# EAGLE design core-feather-shield-adc-imu-basic_v1_0 (EAGLE 9.5.0)
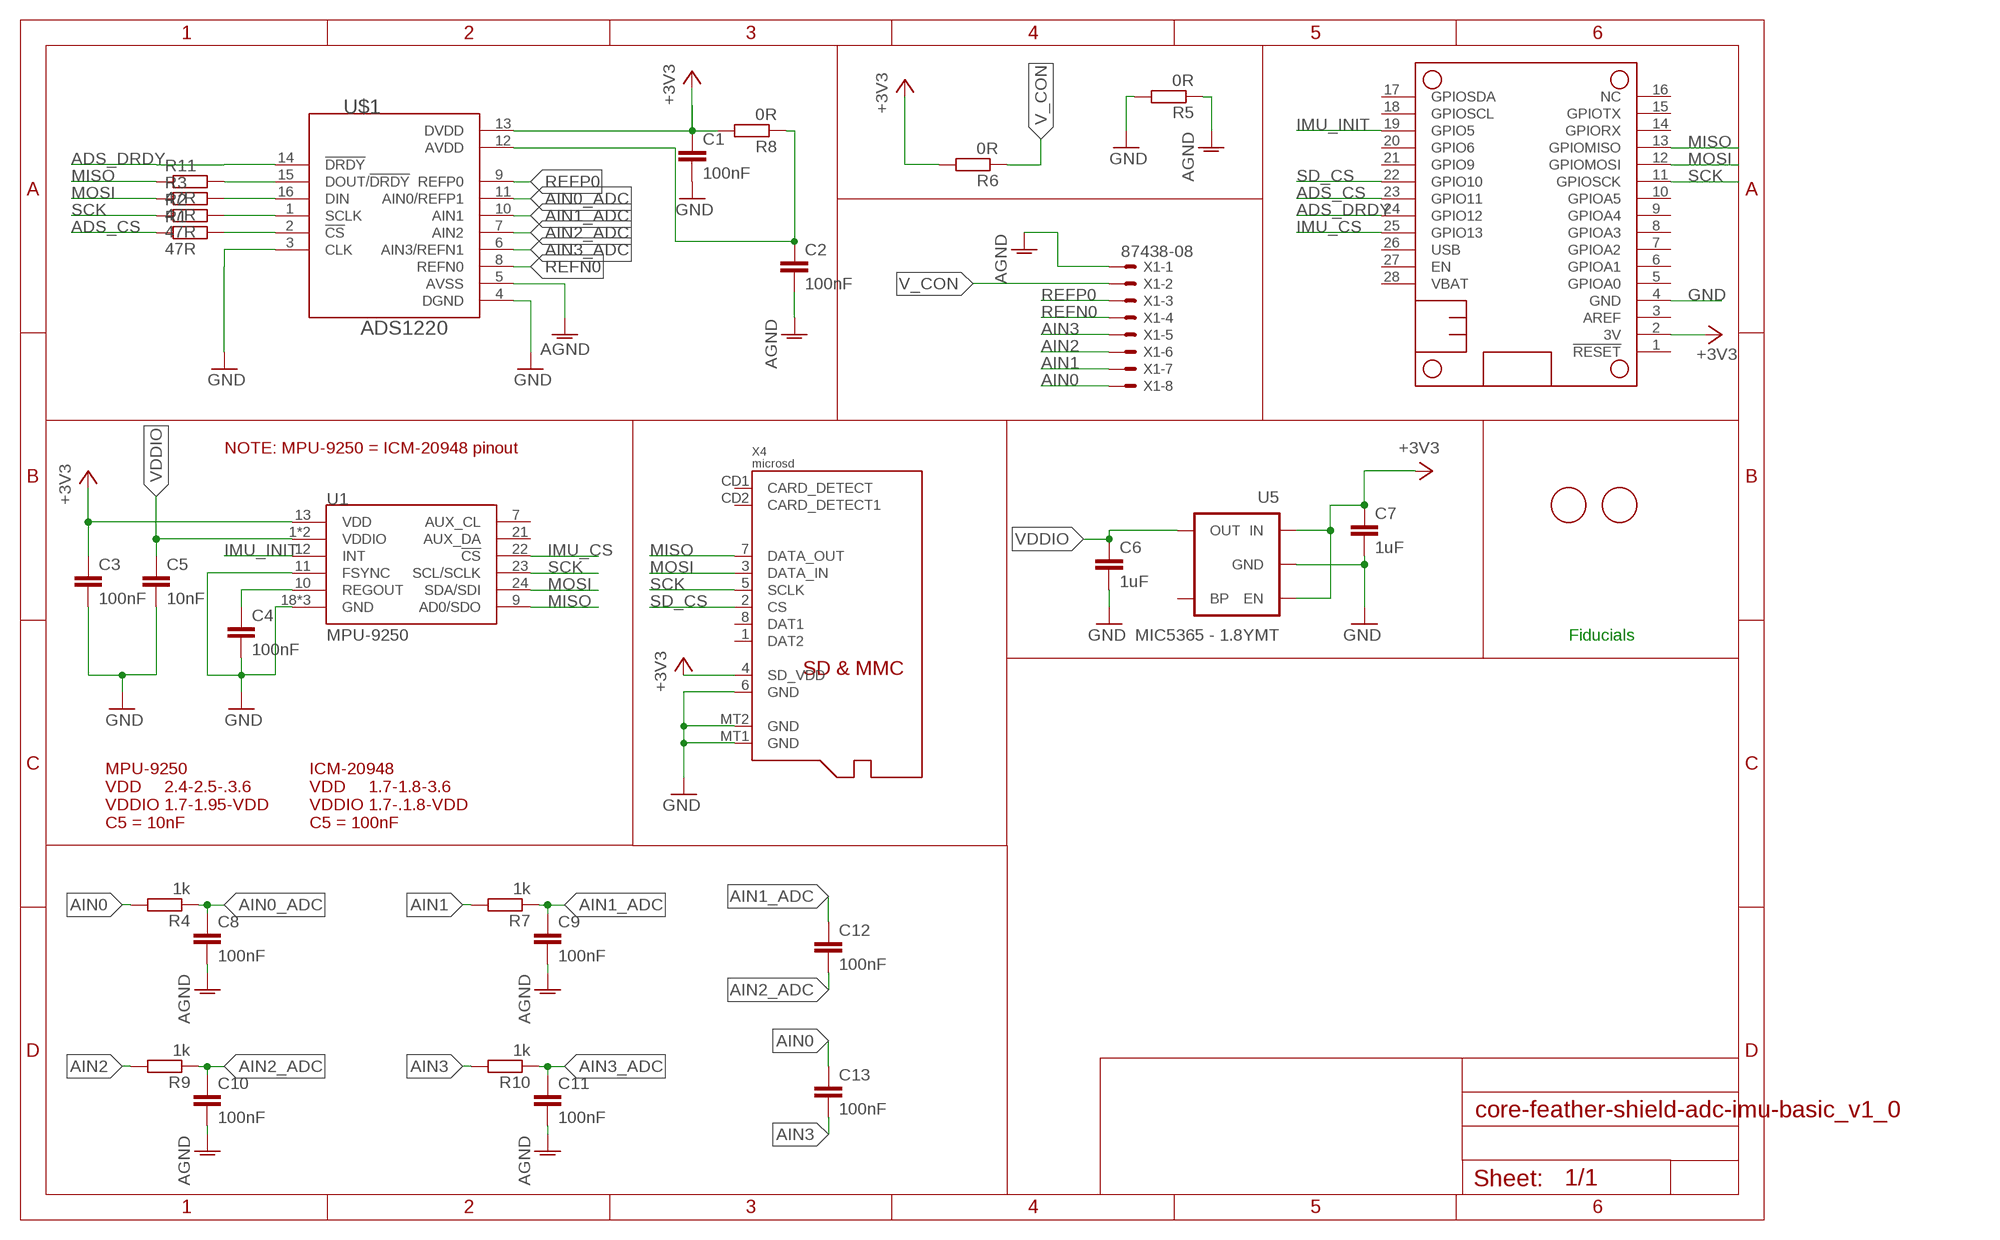
[diagram p0: schematic, sheet 1]

## Parts
C1  100nF  C-EUC0805  [C0805]
C2  100nF  C-EUC0805  [C0805]
C3  100nF  C-EUC0805  [C0805]
C4  100nF  C-EUC0805  [C0805]
C5  10nF  C-EUC0805  [C0805]
C6  1uF  C-EUC0805  [C0805]
C7  1uF  C-EUC0805  [C0805]
C8  100nF  C-EUC0805  [C0805]
C9  100nF  C-EUC0805  [C0805]
C10  100nF  C-EUC0805  [C0805]
C11  100nF  C-EUC0805  [C0805]
C12  100nF  C-EUC0805  [C0805]
C13  100nF  C-EUC0805  [C0805]
MS1  FEATHERWING  [FEATHERWING]
R1  47R  R-EU_R0805  [R0805]
R2  47R  R-EU_R0805  [R0805]
R3  47R  R-EU_R0805  [R0805]
R4  1k  R-EU_R0805  [R0805]
R5  0R  R-EU_R0805  [R0805]
R6  0R  R-EU_R0805  [R0805]
R7  1k  R-EU_R0805  [R0805]
R8  0R  R-EU_R0805  [R0805]
R9  1k  R-EU_R0805  [R0805]
R10  1k  R-EU_R0805  [R0805]
R11  47R  R-EU_R0805  [R0805]
U1  MPU-9250  [QFN24_PAD]
U5  MIC5365 - 1.8YMT  V_REG_LDOSMD2  [SC70]
U$1  ADS1220  [TSSOP-16]
U$8  FIDUCIAL  [FIDUCIAL_1MM]
U$9  FIDUCIAL  [FIDUCIAL_1MM]
X1  87438-08  [87438-08]
X4  microsd  MICROSD  [MICROSD]

## Nets
+3V3: C1.1 C3.1 C7.1 MS1.2(3V) R6.2 R8.2 U1.13(VDD) U5.1(IN) U5.3(EN) U$1.13(DVDD) X4.4(SD_VDD)
ADS_CS: MS1.23(GPIO11) R1.1
ADS_DRDY: MS1.24(GPIO12) U$1.14(!DRDY)
AGND: C2.2 C8.2 C9.2 C10.2 C11.2 R5.1 U$1.5(AVSS) X1.1
AIN0: C13.1 R4.2 X1.8
AIN0_ADC: C8.1 R4.1 U$1.11(AIN0/REFP1)
AIN1: R7.2 X1.7
AIN1_ADC: C9.1 C12.1 R7.1 U$1.10(AIN1)
AIN2: R9.2 X1.6
AIN2_ADC: C10.1 C12.2 R9.1 U$1.7(AIN2)
AIN3: C13.2 R10.2 X1.5
AIN3_ADC: C11.1 R10.1 U$1.6(AIN3/REFN1)
GND: C1.2 C3.2 C4.2 C5.2 C6.2 C7.2 MS1.4(GND) R5.2 U1.11(FSYNC) U1.18(GND) U1.20(GND) U1.CENTER(GND) U5.2(GND) U$1.4(DGND) X4.6(GND) X4.MT1(GND) X4.MT2(GND)
IMU_CS: MS1.25(GPIO13) U1.22(!CS)
IMU_INIT: MS1.19(GPIO5) U1.12(INT)
MISO: MS1.13(GPIOMISO) R11.1 U1.9(AD0/SDO) X4.7(DATA_OUT)
MOSI: MS1.12(GPIOMOSI) R3.1 U1.24(SDA/SDI) X4.3(DATA_IN)
N$1: R11.2 U$1.15(DOUT/!DRDY)
N$3: R3.2 U$1.16(DIN)
N$4: R2.2 U$1.1(SCLK)
N$5: R1.2 U$1.2(!CS)
N$7: U$1.3(CLK)
N$9: C2.1 R8.1 U$1.12(AVDD)
REFN0: U$1.8(REFN0) X1.4
REFP0: U$1.9(REFP0) X1.3
REGOUT: C4.1 U1.10(REGOUT)
SCK: MS1.11(GPIOSCK) R2.1 U1.23(SCL/SCLK) X4.5(SCLK)
SD_CS: MS1.22(GPIO10) X4.2(CS)
V_CON: R6.1 X1.2
VDDIO: C5.1 C6.1 U1.1(VDDIO) U1.8(VDDIO) U5.5(OUT)
Unconnected: MS1.1(!RESET) MS1.3(AREF) MS1.5(GPIOA0) MS1.6(GPIOA1) MS1.7(GPIOA2) MS1.8(GPIOA3) MS1.9(GPIOA4) MS1.10(GPIOA5) MS1.14(GPIORX) MS1.15(GPIOTX) MS1.16(NC) MS1.17(GPIOSDA) MS1.18(GPIOSCL) MS1.20(GPIO6) MS1.21(GPIO9) MS1.26(USB) MS1.27(EN) MS1.28(VBAT) U1.7(AUX_CL) U1.21(AUX_DA) U5.4(BP) X4.1(DAT2) X4.8(DAT1) X4.CD1(CARD_DETECT) X4.CD2(CARD_DETECT1)

## Notes on the sheet
- NOTE: MPU-9250 = ICM-20948 pinout
- Fiducials
- MPU-9250 
  VDD     2.4-2.5-.3.6
  VDDIO 1.7-1.95-VDD
  C5 = 10nF
- ICM-20948
  VDD     1.7-1.8-3.6
  VDDIO 1.7-.1.8-VDD
  C5 = 100nF

## Library data of the parts
C1-C5 C8-C13 = rcl:C-EU: CAPACITOR, European symbol
C6 C7 = rcl:C-EU: CAPACITOR, European symbol; SPICEPREFIX: C
MS1 = adafruit:FEATHERWING
R1-R11 = rcl:R-EU_: RESISTOR, European symbol; SPICEPREFIX: R
U1 = Testing:MPU-9250: NC pin 19. 2-6 & 14-17 not internally connected. May be used for PCB trace routing.; PROD_ID: IC-13192
U5 = rigado-power:V_REG_LDO: Voltage Regulator LDO Standard 150mA LDO voltage regulator in SOT-23 layout. Micrel part MIC5205. BP (by-pass) pin is used to lower output noise with 470pF cap.; DESCRIPTION: IC REG LDO 3.3V 0.15A SC70-5; EACH: 0.267; MFPN: MIC5365-3.3YC5 TR; MFR: Micrel; VEND: Digikey; VPN: 576-3193-1-ND
U$1 = circuitects:ADS1220
U$8 U$9 = audio amplifier example:FIDUCIAL: For use by pick and place machines to calibrate the vision/machine, 1mm By microbuilder.eu
X1 = con-molex:87438-08: Wire-to-Board 1.50mm (.059") Pitch Header - Right Angle, SMT, Shrouded Source: http://www.molex.com/product/micro/87438.html; MF: MOLEX; OC_FARNELL: 1756939; OC_NEWARK: unknown; SPICEPREFIX: X
X4 = microbuilder:MICROSD: MicroSD/Transflash Card Holder with SPI pinout 3M: 2908-05WB-MG 4UConnector: 19656 Footprint courtesy: Adafruit Industries

## Net classes
0 default: width 0.127 mm

## Board
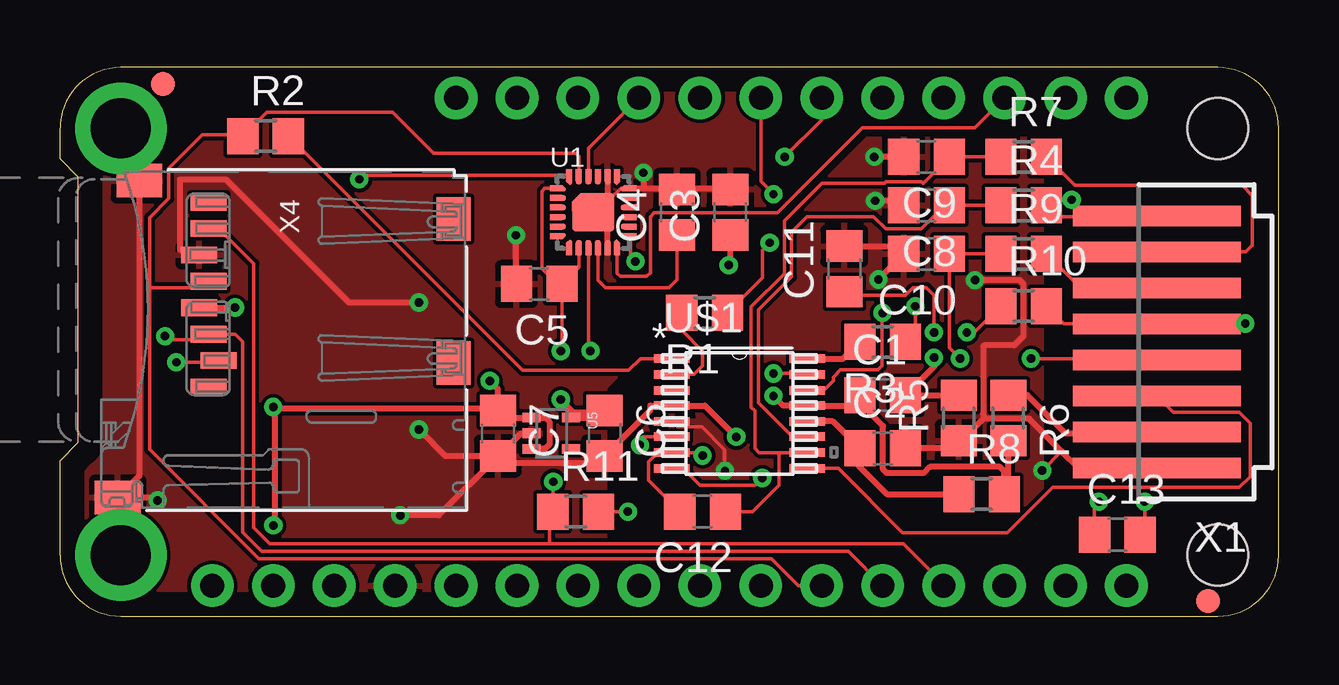
[diagram p1: board, top side]
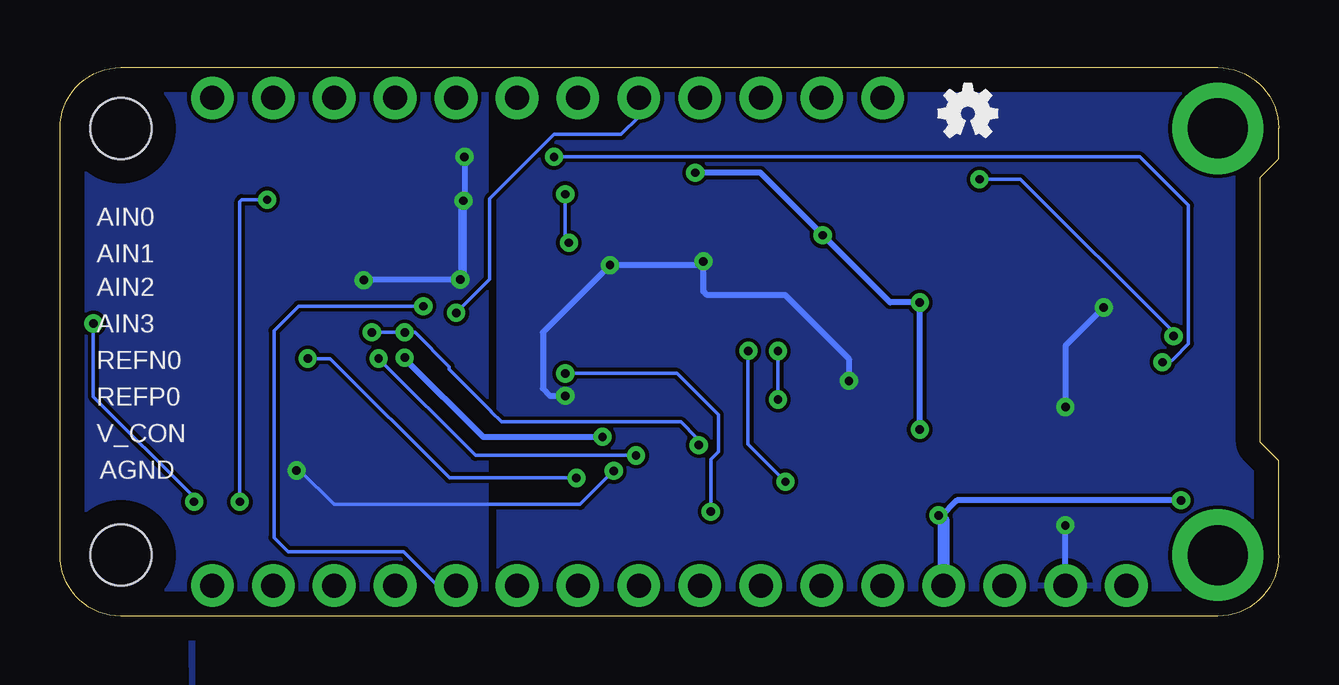
[diagram p2: board, bottom side, seen from below]

Size 50.8 x 22.86 mm. Coordinates in mm from the lower left corner, seen from the top.
Outline: 0,2.54 0,6.48 0.76,7.24 0.76,18.29 0,19.05 0,20.32
Copper layers (1*16): Top 0.035mm / dielectric 1.5mm / Bottom 0.035mm
Design rules "default": minimum track width 6mil, minimum drill 0.35mm, track to track 6mil, track to pad 6mil, pad to pad 6mil, via to via 6mil, smd to smd 6mil, copper to edge 40mil, drill to drill 6mil, minimum pad ring 10mil, minimum via ring 8mil, stop-mask expansion 4mil, vias tented up to drill 0mil, thermal gap 10mil

### Footprints (pad centres in the part's own frame; a part is rotated, then mirrored left to right if it is on the bottom)
C0805 = smd 1.3 x 1.5: 1 -0.95,0; 2 0.95,0
FEATHERWING = drill 1 pad 1.778: 1 6.35,1.27; 2 8.89,1.27; 3 11.43,1.27; 4 13.97,1.27; 5 16.51,1.27; 6 19.05,1.27; 7 21.59,1.27; 8 24.13,1.27; 9 26.67,1.27; 10 29.21,1.27; 11 31.75,1.27; 12 34.29,1.27; 13 36.83,1.27; 14 39.37,1.27; 15 41.91,1.27; 16 44.45,1.27; 17 44.45,21.59; 18 41.91,21.59; 19 39.37,21.59; 20 36.83,21.59; 21 34.29,21.59; 22 31.75,21.59; 23 29.21,21.59; 24 26.67,21.59; 25 24.13,21.59; 26 21.59,21.59; 27 19.05,21.59; 28 16.51,21.59 | drill 2.5 pad 3.81: P$1 2.54,20.32; P$2 2.54,2.54 | hole 2.54: 48.26,20.32; 48.26,2.54
R0805 = smd 1.3 x 1.5: 1 -0.95,0; 2 0.95,0
QFN24_PAD = smd 0.5 x 0.25: 1 -1.55,1; 2 -1.55,0.6; 3 -1.55,0.2; 4 -1.55,-0.2; 5 -1.55,-0.6; 6 -1.55,-1; 13 1.55,-1; 14 1.55,-0.6; 15 1.55,-0.2; 16 1.55,0.2; 17 1.55,0.6; 18 1.55,1 | smd 0.08 x 0.13: 1$1 -1.32,1.06; 1$3 -1.26,0.94; P$33 1.26,-0.94; P$34 1.32,-1.06; P$58 1.26,0.94; P$59 1.32,1.06; P$68 -1.26,-0.94; P$69 -1.32,-1.06 | smd 0.1 x 0.185 rotated 45: 1$2 -1.25,1.024; P$49 1.024,-1.25 | smd 0.14 x 0.14: 1$4 -1.22,0.945; P$23 -0.945,-1.22; P$24 1.22,-0.945; P$36 0.945,1.22; P$51 0.945,-1.22; P$56 1.22,0.945; P$61 -0.945,1.22; P$66 -1.22,-0.945 | smd 0.05 x 0.05: 1$5 -1.175,0.97; P$25 -0.97,-1.175; P$31 1.175,-0.97; P$37 0.97,1.175; P$52 0.97,-1.175; P$57 1.175,0.97; P$62 -0.97,1.175; P$67 -1.175,-0.97 | smd 0.25 x 0.5: 7 -1,-1.55; 8 -0.6,-1.55; 9 -0.2,-1.55; 10 0.2,-1.55; 11 0.6,-1.55; 12 1,-1.55; 19 1,1.55; 20 0.6,1.55; 21 0.2,1.55; 22 -0.2,1.55; 23 -0.6,1.55; 24 -1,1.55 | smd 0.25 x 0.25: CENTER 0,0 | smd 0.4 x 0.4: DBBADFE -0.675,0.24 | smd 0.6 x 1.2: DBBADFE1 -0.575,-0.195 | smd 0.25 x 0.3: P$1 -0.2,1.3; P$3 0.2,1.3; P$5 0.6,1.3; P$11 -0.6,1.3; P$16 0.2,-1.3; P$18 -0.2,-1.3; P$20 -0.6,-1.3; P$26 0.6,-1.3 | smd 0.3 x 0.25: P$2 -1.3,0.2; P$4 -1.3,0.6; P$28 -1.3,-0.2; P$38 -1.3,-0.6; P$40 1.3,0.2; P$42 1.3,-0.2; P$44 1.3,-0.6; P$50 1.3,0.6 | smd 0.1 x 0.185 rotated 225: P$7 1.25,-1.024; P$60 -1.024,1.25 | smd 1.1 x 1.59: P$13 0.325,0 | smd 0.3 x 0.5 rotated 315: P$14 -0.592,0.512 | smd 0.5 x 1.59: P$15 -0.27,0 | smd 0.1 x 0.185 rotated 135: P$22 -1.024,-1.25; P$55 1.25,1.024 | smd 0.13 x 0.08: P$27 -0.94,-1.26; P$29 -1.06,-1.32; P$39 0.94,1.26; P$41 1.06,1.32; P$53 0.94,-1.26; P$54 1.06,-1.32; P$63 -0.94,1.26; P$64 -1.06,1.32 | smd 0.1 x 0.185 rotated 315: P$35 1.024,1.25; P$65 -1.25,-1.024
SC70 = smd 0.4 x 0.75: 1 -0.65,-0.825; 2 0,-0.825; 3 0.65,-0.825; 4 0.65,0.825; 5 -0.65,0.825
TSSOP-16 = smd 1.473 x 0.356: 1 -2.819,2.656; 2 -2.819,1.996; 3 -2.819,1.335; 4 -2.819,0.7; 5 -2.819,0.04; 6 -2.819,-0.595; 7 -2.819,-1.256; 8 -2.819,-1.916; 9 2.819,-1.916; 10 2.819,-1.256; 11 2.819,-0.595; 12 2.819,0.04; 13 2.819,0.7; 14 2.819,1.335; 15 2.819,1.996; 16 2.819,2.656
FIDUCIAL_1MM = smd 1 x 1: 1 0,0
87438-08 = smd 7 x 0.85: 1 0,5.25; 2 0,3.75; 3 0,2.25; 4 0,0.75; 5 0,-0.75; 6 0,-2.25; 7 0,-3.75; 8 0,-5.25
MICROSD = smd 0.7 x 1.5: 1 9,-10.64; 2 7.9,-10.24; 3 6.8,-10.64; 4 5.7,-11.04; 5 4.6,-10.64; 6 3.5,-11.04; 7 2.4,-10.64; 8 1.3,-10.64 | smd 1.8 x 1.4: CD1 2,-0.44; CD2 8,-0.44 | smd 1.4 x 1.9: MT1 0.4,-13.54; MT2 13.6,-14.44

### Placement (x,y rotation side)
C1  34.29,9.21 0 top
C2  34.29,6.99 0 top
C3  27.94,16.83 90 top
C4  25.72,16.83 90 top
C5  19.98,13.84 180 top
C6  22.7,7.62 270 top
C7  18.26,7.62 270 top
C8  36.12,17.11 180 top
C9  36.12,19.14 180 top
C10  36.12,15.09 180 top
C11  32.7,14.47 90 top
C12  26.78,4.36 180 top
C13  44.07,3.39 0 top
FRAME2  FRAME-LETTER  [CREATIVE_COMMONS]  -0.38,-20.07 0 top  (outside the outline)
LOGO1  OSHW-LOGOMINI  [OSHW-LOGO-MINI]  12.95,20.95 0 bottom
LOGO2  REVISION  [REVISION]  11.05,-22.61 0 top  (outside the outline)
MS1  0,0 0 top
R1  26.87,12.64 180 top
R2  8.57,20 0 top
R3  34.29,11.43 180 top
R4  40.16,17.11 0 top
R5  37.47,8.26 90 top
R6  39.53,8.26 270 top
R7  40.16,19.14 0 top
R8  38.42,5.08 0 top
R9  40.16,15.09 0 top
R10  40.16,12.91 0 top
R11  21.49,4.36 0 top
U1  22.22,16.83 0 top
U5  20.48,7.62 270 top
U$1  28.32,8.07 0 top
U$8  4.29,22.17 0 top
U$9  47.86,0.63 0 top
X1  45.72,11.43 180 top
X4  16.85,18.55 270 top

### Tracks (layer width: path | path; a pad name or v marks a point on that pad's centre or on a via)
+3V3  (via drill 0.35)
  Top 0.152: U1.13 23.77,14.99 v23.98,14.78 | 8.97,8.63 v8.89,8.71
  Top 0.254: 32.91,8.77 C1.1 33.34,8.89 33.42,8.81 | R8.2 39.37,6.03 | R6.2 39.53,5.88 39.37,6.03 | 33.42,8.81 34.31,7.92 34.31,6.12 34.47,5.96 36.01,5.96 36.27,6.22 39.18,6.22 39.37,6.03 | X4.4 7.28,12.85 v7.3,12.86 | C7.1 18.26,9.46 v17.92,9.8 | C7.1 18.2,8.63 8.97,8.63 8.97,3.86 v8.89,3.78 | 33.42,8.81 33.38,8.77 U$1.13 30.15,8.77 v29.74,9.18 | C7.1 18.56,8.27 U5.1 20.23,8.27 20.41,8.09 20.41,7.16 20.22,6.97 U5.3 | v27.87,14.62 27.94,14.69 C3.1
  Bottom 0.254: v7.3,12.86 8.89,11.27 v8.89,8.71 | MS1.2 v8.89,3.78 | v29.74,9.18 30.36,9.18 30.67,9.49 30.67,11.82 v27.87,14.62 24.14,14.62 v23.98,14.78 23.98,13.54 23.83,13.38 20.56,13.38 17.92,10.73 v17.92,9.8
  pour Bottom: -1.69,25.2 32.54,25.2 32.54,-2.8 -1.53,-2.8 -1.69,-2.96
ADS_CS  (via drill 0.35)
  Top 0.152: MS1.23 29.21,18.11 v29.74,17.58 | v29.59,15.56 29.27,15.25 29.27,14.09 R1.1
  Bottom 0.152: v29.74,17.58 29.74,15.71 v29.59,15.56
ADS_DRDY  (via drill 0.35)
  Top 0.152: U$1.14 31.84,9.41 32.23,9.8 32.23,9.96 32.54,10.27 34.1,10.27 34.25,10.42 34.25,12.6 v34.29,12.63
  Bottom 0.152: MS1.24 26.67,20.81 27.41,20.07 30.21,20.07 32.88,17.39 32.88,14.04 v34.29,12.63
AGND  (via drill 0.35)
  Top 0.152: v27.72,6.05 27.7,6.05 27.7,6.94 26.76,7.88 25.73,7.88 U$1.5 | v40.94,6.07 41.75,6.88 | 38.53,11.28 38.48,11.23 | 34.84,15.42 C10.2
  Top 0.254: R5.1 | R5.1 37.15,6.99 C2.2 | X1.1 42.45,6.18 41.75,6.88 40.39,8.23 38.5,8.23 38.48,8.21 | R5.1 37.57,7.3 38.48,8.21 | C9.2 v33.94,19.14 | C8.2 34.97,17.31 v33.98,17.31 | C10.2 34.11,14.04 v34.11,14.03 | C11.2 34.84,15.42 | v38.14,14 40.01,14 40.16,13.85 40.16,11.67 39.78,11.28 38.53,11.28 | 38.48,11.23 38.48,9.98 38.49,9.97 38.49,8.44 38.48,8.43 38.48,8.21
  Bottom 0.152: v40.94,6.07 40.79,6.07 39.37,4.65 29.12,4.65 v27.72,6.05 | v34.11,14.03 34.11,17.44 33.94,17.27
  Bottom 0.254: v33.94,19.14 33.94,17.27 | v33.98,17.31 33.98,14.16 v34.11,14.03 38.12,14.03 v38.14,14
  pour Top: 23.21,0.31 40.94,0.31 40.94,19.91 33.63,19.91 23.05,9.33 23.05,0.47
  pour Bottom: 33.01,25.2 33.01,-3.42 56.34,-3.42 56.34,24.74 33.47,24.74
AGND1
  pour Bottom: 45.23,18.82 45.23,-10.2 45.71,18.35
AIN0  (via drill 0.35)
  Top 0.152: X1.8 46.08,16.68 | 46.08,16.68 49.15,16.68 | R4.2 41.24,16.98 | 41.24,16.98 41.58,16.65 46.04,16.65 46.08,16.68 | C13.1 43.12,4.58 v43.31,4.76 | v42.16,17.35 41.61,17.35 41.24,16.98
  Bottom 0.152: v43.31,4.76 43.31,17.27 43.23,17.35 v42.16,17.35
AIN0_ADC
  Top 0.152: R4.1 37.21,17.11 C8.1 36.89,17.11 35.91,16.14 34.42,16.14 33.91,16.65 31.14,16.65 30.5,16 30.5,14.14 29.12,12.76 29.12,8.9 30.62,7.4 31.06,7.4 U$1.11 31.13,7.47
AIN1
  Top 0.152: 42.75,15.18 X1.7 49.43,15.18 49.71,15.46 49.71,17.53 49.28,17.96 42.3,17.96 41.12,19.14 R7.2
AIN1_ADC
  Top 0.152: R7.1 C9.1 35.98,18.05 35.96,18.05 35.91,18.09 34.42,18.09 34.38,18.05 31.76,18.05 30.19,16.48 30.19,14.27 28.81,12.88 28.81,8.71 28.96,8.56 28.96,7 29.14,6.82 29.9,6.82 29.97,6.82 | 29.97,6.82 U$1.10 | 28.31,4.36 C12.1 28.87,4.36 29.97,5.46 29.97,6.82
AIN2
  Top 0.152: R9.2 42.53,13.68 X1.6
AIN2_ADC  (via drill 0.35)
  Top 0.152: v37.52,10.73 37.07,11.19 C10.1 R9.1 | v26.79,6.69 v26.78,6.69 26.71,6.77 26.66,6.82 U$1.7 24.93,6.82 24.54,6.43 24.54,5.65 C12.2
  Bottom 0.152: v26.79,6.69 33.48,6.69 v37.52,10.73
AIN3  (via drill 0.35)
  Top 0.152: R10.2 41.85,12.18 X1.5 49.39,12.18 v49.41,12.19 | v45.21,4.76 45.21,3.58 C13.2
  Bottom 0.152: v49.41,12.19 49.41,9.15 45.21,4.95 v45.21,4.76
AIN3_ADC  (via drill 0.35)
  Top 0.152: R10.1 38.12,11.82 v37.8,11.82 | v24.17,7.12 24.06,7.23 24.31,7.48 U$1.6 | v36.43,11.82 36.43,13.38 36.12,13.69 36.1,13.68 35.56,13.68 35.24,13.36 32.85,13.36 C11.1
  Bottom 0.152: v37.8,11.82 v36.43,11.82 36,11.82 34.58,10.4 34.58,10.28 32.84,8.54 32.84,8.52 32.4,8.09 24.92,8.09 24.26,7.43 24.17,7.43 v24.17,7.12
GND  (via drill 0.35)
  Top 0.152: 25.23,8.77 U$1.4 | U1.18 23.38,17.83 22.94,17.38 22.78,17.38 U1.CENTER 22.82,16.23 | 25.23,17.83 25.67,17.83 C4.2 C3.2 | 22.42,6.39 C6.2 | C1.2 34.8,9.65
  Top 0.254: R5.2 C1.2 36.43,10.4 v36.43,10.77 | C7.2 15.79,4.2 v14.18,4.2 | X4.MT1 3.31,5.85 X4.MT2 3.94,4.95 v4.07,4.82 | v14.96,13.07 12.04,13.07 6.9,18.2 5,18.2 5,15.25 5.61,15.25 X4.6 | C7.2 16.07,6.67 v14.96,7.78 | v24.32,18.48 24.32,17.85 24.29,17.83 | 24.29,17.83 25.23,17.83 27.89,17.83 C3.2 | U1.18 24.29,17.83 | C7.2 19.21,7.62 U5.2 | C7.2 18.54,6.39 22.42,6.39 | U$1.4 26.88,8.77 v28.18,7.47 | C6.2 24.61,8.57 24.61,8.77 25.23,8.77 | C5.2 19.01,13.86 v19.01,15.87 | U1.20 22.82,17.43 22.78,17.38 | U1.11 22.82,16.23
  Bottom 0.254: 14.11,4.12 13.97,3.99 | v14.96,7.78 v14.96,13.07 16.21,13.07 v19.01,15.87 21.61,18.48 v24.32,18.48 | v4.07,4.82 13.4,4.82 14.11,4.12 | v36.43,10.77 36.43,10.73 33.16,7.47 v28.18,7.47 | v14.18,4.2 14.11,4.12
  Bottom 0.508: v14.18,4.2 13.97,3.99 MS1.4
  pour Top: 33.63,20.38 41.25,20.38 41.25,0 23.98,0 23.98,-2.49 23.83,-2.64 55.57,-2.64 55.57,24.11 -4.18,24.11 -4.33,23.96 -4.33,-3.11 -4.49,-3.27 22.58,-3.27 22.74,-3.11 22.74,9.49
IMU_CS
  Top 0.152: U1.22 22.02,19.48 MS1.25
IMU_INIT
  Top 0.152: U1.12 23.22,14.29 23.36,14.16 24.45,14.16 24.61,14.31 24.61,16.65 24.76,16.8 29.91,16.8 33.46,20.34 38.12,20.34 MS1.19
MISO  (via drill 0.35)
  Top 0.152: 20.41,3.02 35.15,3.02 36.83,1.34 MS1.13 | 20.41,3.02 8.75,3.02 8.07,3.69 8.07,14.69 6.61,16.15 X4.7 | U1.9 22.02,11.14 v22.11,11.05 v22.12,11.05 | v20.56,5.6 20.54,5.58 R11.1 20.41,4.22 20.41,3.17 20.41,3.02
  Bottom 0.152: v20.56,5.6 22.12,7.16 v22.12,11.05 v22.11,11.05
MOSI  (via drill 0.35)
  Top 0.152: 5.94,11.75 X4.3 | 5.94,11.75 7.3,11.75 7.62,11.43 7.62,3.49 8.41,2.7 32.86,2.7 MS1.12 | U1.24 12.65,18.38 v12.47,18.2 | 5.94,11.75 5.7,11.51 4.54,11.51 v4.38,11.67 | R3.1 35.65,11.84 v35.65,12.91
  Bottom 0.152: v12.47,18.2 10.76,18.2 4.38,11.82 v4.38,11.67 | v35.65,12.91 40.86,12.91 41.88,11.89 41.88,3.27 41.3,2.69 36.48,2.69 35.05,1.27 MS1.12
N$1  (via drill 0.35)
  Top 0.152: R11.2 v23.67,4.36 | v29.74,10.11 31.1,10.11 U$1.15
  Bottom 0.152: v23.67,4.36 23.67,6.53 23.36,6.84 23.36,8.4 25.07,10.11 v29.74,10.11
N$3
  Top 0.254: U$1.16 32.64,10.73 R3.2
N$4
  Top 0.152: U$1.1 24.2,10.73 23.7,10.24 19.29,10.24 R2.2
N$5
  Top 0.152: R1.2 25.92,11.91 26.78,11.05 26.78,10.42 26.43,10.07 U$1.2
N$9
  Top 0.254: U$1.12 32.21,8.11 C2.1 33.28,6.93 33.28,6.26 34.46,5.08 R8.1
REFN0  (via drill 0.35)
  Top 0.152: v40.48,10.73 45.67,10.73 X1.4 | v29.27,5.76 28.96,5.45 26.68,5.45 25.97,6.16 U$1.8
  Bottom 0.152: v29.27,5.76 34.56,5.76 39.54,10.73 v40.48,10.73
REFP0
  Top 0.152: X1.3 46.41,8.49 49.16,8.49 49.6,8.04 49.6,5.82 49.16,5.37 41.38,5.37 39.49,3.48 35.12,3.48 32.44,6.16 U$1.9
REGOUT
  Top 0.152: U1.10 22.43,14 22.74,13.69 25.38,13.69 25.72,14.02 C4.1
SCK
  Top 0.152: MS1.11 30.79,1.27 29.66,2.4 8.28,2.4 3.74,6.94 3.74,13.69 | 3.74,13.69 3.74,16.61 4.54,17.41 4.54,18.67 5.92,20.05 7.67,20.05 | 7.3,20 R2.1 7.67,20.05 | 7.67,20.05 8.62,21 13.87,21 15.58,19.29 21.5,19.29 21.62,19.16 U1.23 | X4.5 5.95,13.69 3.74,13.69
SD_CS  (via drill 0.35)
  Top 0.152: X4.2 6.54,10.58 v4.85,10.58 | v30.21,19.14 31.75,20.68 MS1.22
  Bottom 0.152: v30.21,19.14 5.78,19.14 3.76,17.11 3.76,11.36 4.38,10.73 4.54,10.58 v4.85,10.58
V_CON
  Top 0.254: 39.85,9.53 R6.1 40.33,9.21 41.91,7.62 45.66,7.62 X1.2
VDDIO  (via drill 0.35)
  Top 0.152: 21.65,15.25 U1.8 21.62,14.54 C5.1 | C5.1 20.72,13.84 20.09,14.47 20.09,17.71 20.21,17.83 U1.1 | C5.1 20.93,11.1 v20.87,11.05
  Top 0.254: U5.5 22.09,8.27 22.33,8.5 | C6.1 22.64,8.5 22.33,8.5 | v20.87,9.02 21.39,8.5 22.33,8.5
  Bottom 0.152: v20.87,11.05 v20.87,9.02

### Text on the board
bNames: AIN0 | AIN1 | AIN2 | AIN3 | REFN0 | REFP0 | V_CON | AGND
tDocu: M. Hessinger | S. Suppelt